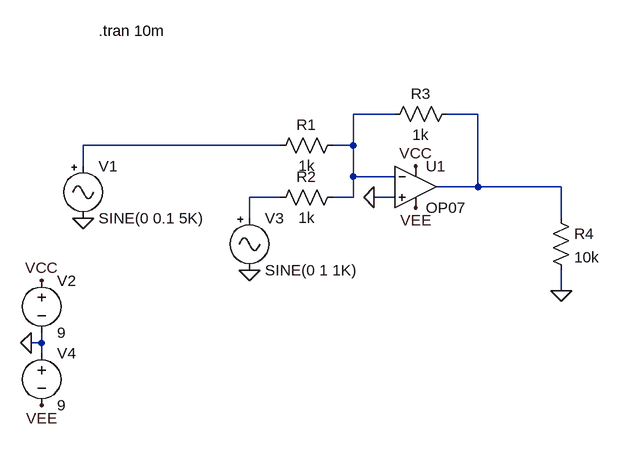
[diagram p0: schematic mixer.asc]
mixer.asc, the LTspice schematic file:
Version 4
SHEET 1 976 764
WIRE 656 240 592 240
WIRE 784 240 736 240
WIRE 480 288 176 288
WIRE 592 288 592 240
WIRE 592 288 560 288
WIRE 176 320 176 288
WIRE 592 336 592 288
WIRE 656 336 592 336
WIRE 784 352 784 240
WIRE 784 352 720 352
WIRE 912 352 784 352
WIRE 480 368 432 368
WIRE 592 368 592 336
WIRE 592 368 560 368
WIRE 656 368 624 368
WIRE 432 400 432 368
WIRE 912 400 912 352
WIRE 912 512 912 480
WIRE 112 592 112 576
WIRE 112 592 96 592
WIRE 112 608 112 592
FLAG 176 400 0
FLAG 112 496 VCC
FLAG 96 592 0
FLAG 432 480 0
FLAG 112 688 VEE
FLAG 688 384 VEE
FLAG 688 320 VCC
FLAG 624 368 0
FLAG 912 512 0
SYMBOL Misc/signal 176 304 R0
SYMATTR InstName V1
SYMATTR Value SINE(0 0.1 5K)
SYMBOL voltage 112 480 R0
SYMATTR InstName V2
SYMATTR Value 9
SYMBOL OpAmps/OP07 688 288 R0
SYMATTR InstName U1
SYMBOL res 576 272 R90
WINDOW 0 0 56 VBottom 2
WINDOW 3 32 56 VTop 2
SYMATTR InstName R1
SYMATTR Value 1k
SYMBOL res 576 352 R90
WINDOW 0 0 56 VBottom 2
WINDOW 3 32 56 VTop 2
SYMATTR InstName R2
SYMATTR Value 1k
SYMBOL res 752 224 R90
WINDOW 0 0 56 VBottom 2
WINDOW 3 32 56 VTop 2
SYMATTR InstName R3
SYMATTR Value 1k
SYMBOL Misc/signal 432 384 R0
SYMATTR InstName V3
SYMBOL voltage 112 592 R0
SYMATTR InstName V4
SYMATTR Value 9
SYMBOL res 896 384 R0
SYMATTR InstName R4
SYMATTR Value 10k
TEXT 200 112 Left 2 !.tran 10m

The netlist it stands for:
* mixer.asc
V1 N003 0 SINE(0 0.1 5K)
V2 VCC 0 9
XU1 0 N001 VCC VEE N002 LT1001  ; OP07, pins In+ In- V+ V- OUT
R1 N001 N003 1k
R2 N001 N004 1k
R3 N002 N001 1k
V3 N004 0 SINE(0 1 1K)
V4 0 VEE 9
R4 N002 0 10k
.tran 10m
.lib LTC.lib
.backanno
.end